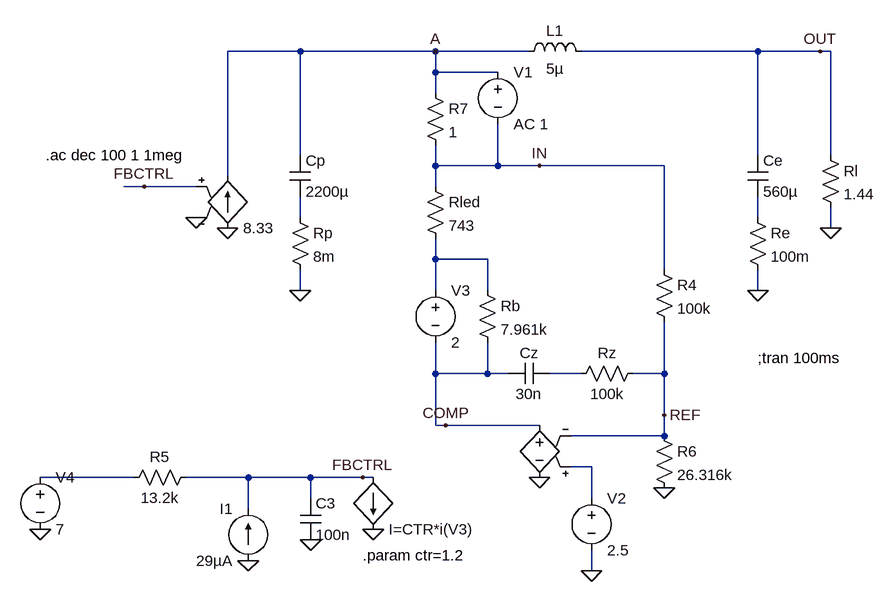
[diagram p0: schematic filter.asc]
filter.asc, the LTspice schematic file:
Version 4
SHEET 1 1244 680
WIRE 352 -160 240 -160
WIRE 560 -160 352 -160
WIRE 704 -160 560 -160
WIRE 1056 -160 784 -160
WIRE 1152 -160 1056 -160
WIRE 1168 -160 1152 -160
WIRE 560 -128 560 -160
WIRE 656 -128 560 -128
WIRE 560 -96 560 -128
WIRE 352 0 352 -160
WIRE 1056 0 1056 -160
WIRE 1168 0 1168 -160
WIRE 560 16 560 -16
WIRE 656 16 656 -48
WIRE 656 16 560 16
WIRE 720 16 656 16
WIRE 912 16 720 16
WIRE 240 32 240 -160
WIRE 112 48 80 48
WIRE 192 48 112 48
WIRE 560 48 560 16
WIRE 352 96 352 64
WIRE 1056 96 1056 64
WIRE 1168 112 1168 80
WIRE 560 160 560 128
WIRE 640 160 560 160
WIRE 912 176 912 16
WIRE 352 208 352 176
WIRE 560 208 560 160
WIRE 640 208 640 160
WIRE 1056 208 1056 176
WIRE 560 336 560 288
WIRE 640 336 640 288
WIRE 640 336 560 336
WIRE 672 336 640 336
WIRE 784 336 736 336
WIRE 912 336 912 256
WIRE 912 336 864 336
WIRE 912 400 912 336
WIRE 560 416 560 336
WIRE 576 416 560 416
WIRE 720 416 576 416
WIRE 912 432 912 400
WIRE 912 432 768 432
WIRE 800 480 768 480
WIRE 96 496 -48 496
WIRE 272 496 176 496
WIRE 368 496 272 496
WIRE 448 496 368 496
WIRE 464 496 448 496
WIRE 368 528 368 496
WIRE 800 528 800 480
WIRE 272 544 272 496
WIRE 800 640 800 608
FLAG 192 96 0
FLAG 240 112 0
FLAG 352 208 0
FLAG 1056 208 0
FLAG 1168 112 0
FLAG 1152 -160 OUT
FLAG 800 640 0
FLAG 720 496 0
FLAG 912 512 0
FLAG 464 576 0
FLAG -48 576 0
FLAG 272 624 0
FLAG 448 496 FBCTRL
FLAG 576 416 COMP
FLAG 912 400 REF
FLAG 368 592 0
FLAG 112 48 FBCTRL
FLAG 560 -160 A
FLAG 720 16 IN
SYMBOL cap 336 0 R0
SYMATTR InstName Cp
SYMATTR Value 2200µ
SYMATTR SpiceLine Rser=0
SYMBOL res 336 80 R0
SYMATTR InstName Rp
SYMATTR Value 8m
SYMBOL ind 688 -144 R270
WINDOW 0 32 56 VTop 2
WINDOW 3 5 56 VBottom 2
SYMATTR InstName L1
SYMATTR Value 5µ
SYMATTR SpiceLine Rser=0
SYMBOL cap 1040 0 R0
SYMATTR InstName Ce
SYMATTR Value 560µ
SYMATTR SpiceLine Rser=0
SYMBOL res 1040 80 R0
SYMATTR InstName Re
SYMATTR Value 100m
SYMBOL res 1152 -16 R0
SYMATTR InstName Rl
SYMATTR Value 1.44
SYMBOL g 240 16 R0
WINDOW 0 24 16 Invisible 2
SYMATTR InstName G1
SYMATTR Value 8.33
SYMBOL res 896 160 R0
SYMATTR InstName R4
SYMATTR Value 100k
SYMBOL voltage 800 512 R0
SYMATTR InstName V2
SYMATTR Value 2.5
SYMBOL res 544 32 R0
SYMATTR InstName Rled
SYMATTR Value 743
SYMBOL res 896 416 R0
SYMATTR InstName R6
SYMATTR Value 26.316k
SYMBOL voltage 560 192 R0
SYMATTR InstName V3
SYMATTR Value 2
SYMBOL bi 464 496 R0
WINDOW 0 24 0 Invisible 2
SYMATTR InstName B1
SYMATTR Value I=CTR*i(V3)
SYMBOL res 192 480 R90
WINDOW 0 0 56 VBottom 2
WINDOW 3 32 56 VTop 2
SYMATTR InstName R5
SYMATTR Value 13.2k
SYMBOL voltage -48 480 R0
WINDOW 123 0 0 Left 0
WINDOW 39 0 0 Left 0
SYMATTR InstName V4
SYMATTR Value 7
SYMBOL current 272 624 R180
WINDOW 0 24 80 Left 2
WINDOW 3 24 0 Left 2
SYMATTR InstName I1
SYMATTR Value 29µA
SYMBOL cap 736 320 R90
WINDOW 0 0 32 VBottom 2
WINDOW 3 32 32 VTop 2
SYMATTR InstName Cz
SYMATTR Value 30n
SYMBOL res 880 320 R90
WINDOW 0 0 56 VBottom 2
WINDOW 3 32 56 VTop 2
SYMATTR InstName Rz
SYMATTR Value 100k
SYMBOL res 624 192 R0
SYMATTR InstName Rb
SYMATTR Value 7.961k
SYMBOL e2 720 400 M0
WINDOW 0 24 16 Invisible 2
WINDOW 3 24 96 Invisible 2
SYMATTR InstName E1
SYMATTR Value 10Meg
SYMBOL cap 352 528 R0
SYMATTR InstName C3
SYMATTR Value 100n
SYMBOL voltage 656 -144 R0
SYMATTR InstName V1
SYMATTR Value AC 1
SYMBOL res 544 -112 R0
SYMATTR InstName R7
SYMATTR Value 1
TEXT -40 0 Left 2 !.ac dec 100 1 1meg
TEXT 448 616 Left 2 !.param ctr=1.2
TEXT 1056 312 Left 2 !;tran 100ms

The netlist it stands for:
* filter.asc
Cp A N001 2200µ Rser=0
Rp N001 0 8m
L1 A OUT 5µ Rser=0
Ce OUT N002 560µ Rser=0
Re N002 0 100m
Rl OUT 0 1.44
G1 0 A FBCTRL 0 8.33
R4 IN REF 100k
V2 N005 0 2.5
Rled IN N003 743
R6 REF 0 26.316k
V3 N003 COMP 2
B1 FBCTRL 0 I=CTR*i(V3)
R5 FBCTRL N006 13.2k
V4 N006 0 7
I1 0 FBCTRL 29µA
Cz N004 COMP 30n
Rz REF N004 100k
Rb N003 COMP 7.961k
E1 COMP 0 N005 REF 10Meg
C3 FBCTRL 0 100n
V1 A IN AC 1
R7 A IN 1
.ac dec 100 1 1meg
.param ctr=1.2
;tran 100ms
.backanno
.end